# EAGLE design Renesas_Raspi2_Add_On_V1 (EAGLE 9.1.3)

## Sheet 1 of 2
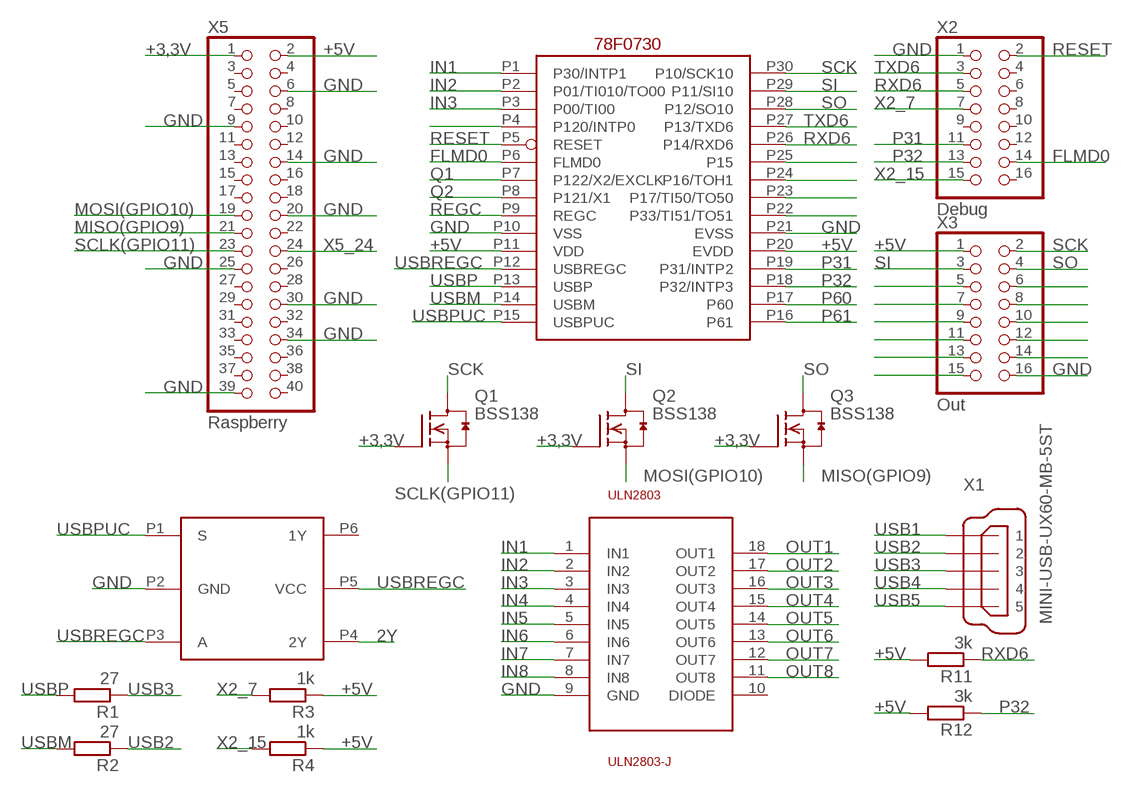
[diagram p0: schematic, sheet 1]

### Parts
Q1  BSS138  [SOT23]
Q2  BSS138  [SOT23]
Q3  BSS138  [SOT23]
R1  27  R-EU_R0603  [R0603]
R2  27  R-EU_R0603  [R0603]
R3  1k  R-EU_R0603  [R0603]
R4  1k  R-EU_R0603  [R0603]
R11  3k  R-EU_R0603  [R0603]
R12  3k  R-EU_R0603  [R0603]
U$1  78F0730_CAB_AX  [SSOP30]
U$2  74LVC1G18  [74LVC1G18]
ULN2803  ULN2803-J  [SOJ18-45]
X1  MINI-USB-UX60-MB-5ST  [UX60-MB-5ST]
X2  Debug  PINHD-2X8  [2X08]
X3  Out  PINHD-2X8  [2X08]
X5  Raspberry  PINHD-2X20  [2X20]

### Nets
2Y: U$2.P4(2Y) ; also sheet 2
+3,3V: Q1.1(G) Q2.1(G) Q3.1(G) X5.1 ; also sheet 2
+5V: R3.1 R4.1 R11.2 R12.2 U$1.P11(VDD) U$1.P20(EVDD) X3.1 X5.2 ; also sheet 2
FLMD0: U$1.P6(FLMD0) X2.14
GND: U$1.P10(VSS) U$1.P21(EVSS) U$2.P2(GND) ULN2803.9(GND) X2.1 X3.16 X5.6 X5.9 X5.14 X5.20 X5.25 X5.30 X5.34 X5.39 ; also sheet 2
IN1: U$1.P1(P30/INTP1) ULN2803.1(IN1)
IN2: U$1.P2(P01/TI010/TO00) ULN2803.2(IN2)
IN3: U$1.P3(P00/TI00) ULN2803.3(IN3)
IN4: ULN2803.4(IN4)
IN5: ULN2803.5(IN5)
IN6: ULN2803.6(IN6)
IN7: ULN2803.7(IN7)
IN8: ULN2803.8(IN8)
MISO(GPIO9): Q3.2(S) X5.21 ; also sheet 2
MOSI(GPIO10): Q2.2(S) X5.19 ; also sheet 2
N$4: U$1.P25(P15)
N$5: X3.5
N$6: X3.7
N$7: U$1.P4(P120/INTP0)
N$8: X3.9
N$9: X3.11
N$10: X3.13
N$11: X3.15
N$12: U$1.P24(P16/TOH1)
N$13: U$1.P23(P17/TI50/TO50)
N$14: X3.6
N$15: X3.8
N$16: X3.10
N$17: X3.12
N$18: X3.14
N$19: U$1.P22(P33/TI51/TO51)
OUT1: ULN2803.18(OUT1)
OUT2: ULN2803.17(OUT2)
OUT3: ULN2803.16(OUT3)
OUT4: ULN2803.15(OUT4)
OUT5: ULN2803.14(OUT5)
OUT6: ULN2803.13(OUT6)
OUT7: ULN2803.12(OUT7)
OUT8: ULN2803.11(OUT8)
P31: U$1.P19(P31/INTP2) X2.11
P32: R12.1 U$1.P18(P32/INTP3) X2.13
P60: U$1.P17(P60) ; also sheet 2
P61: U$1.P16(P61) ; also sheet 2
Q1: U$1.P7(P122/X2/EXCLK) ; also sheet 2
Q2: U$1.P8(P121/X1) ; also sheet 2
REGC: U$1.P9(REGC) ; also sheet 2
RESET: U$1.P5(RESET) X2.2 ; also sheet 2
RXD6: R11.1 U$1.P26(P14/RXD6) X2.5
SCK: Q1.3(D) U$1.P30(P10/SCK10) X3.2 ; also sheet 2
SCLK(GPIO11): Q1.2(S) X5.23 ; also sheet 2
SI: Q2.3(D) U$1.P29(P11/SI10) X3.3 ; also sheet 2
SO: Q3.3(D) U$1.P28(P12/SO10) X3.4 ; also sheet 2
TXD6: U$1.P27(P13/TXD6) X2.3
USB1: X1.1
USB2: R2.1 X1.2
USB3: R1.1 X1.3 ; also sheet 2
USB4: X1.4
USB5: X1.5
USBM: R2.2 U$1.P14(USBM)
USBP: R1.2 U$1.P13(USBP)
USBPUC: U$1.P15(USBPUC) U$2.P1(S)
USBREGC: U$1.P12(USBREGC) U$2.P3(A) U$2.P5(VCC) ; also sheet 2
X2_7: R3.2 X2.7
X2_15: R4.2 X2.15 ; also sheet 2
X5_24: X5.24 ; also sheet 2
Unconnected: U$2.P6(1Y) ULN2803.10(DIODE) X2.4 X2.6 X2.8 X2.9 X2.10 X2.12 X2.16 X5.3 X5.4 X5.5 X5.7 X5.8 X5.10 X5.11 X5.12 X5.13 X5.15 X5.16 X5.17 X5.18 X5.22 X5.26 X5.27 X5.28 X5.29 X5.31 X5.32 X5.33 X5.35 X5.36 X5.37 X5.38 X5.40

### Notes on the sheet
- 78F0730

## Sheet 2 of 2
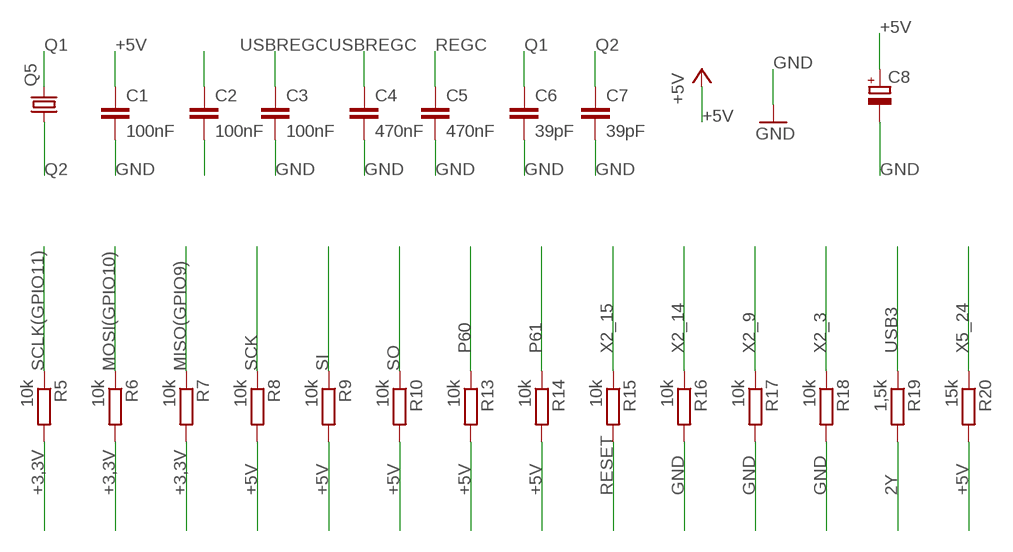
[diagram p1: schematic, sheet 2]

### Parts
C1  100nF  C-EUC0603  [C0603]
C2  100nF  C-EUC0603  [C0603]
C3  100nF  C-EUC0603  [C0603]
C4  470nF  C-EUC0603  [C0603]
C5  470nF  C-EUC0603  [C0603]
C6  39pF  C-EUC0603  [C0603]
C7  39pF  C-EUC0603  [C0603]
C8  CPOL-EUSANYO_SMD_F8  [SANYO-OSCON_SMD_F8]
Q5  CRYSTALHC49UP  [HC49UP]
R5  10k  R-EU_R0603  [R0603]
R6  10k  R-EU_R0603  [R0603]
R7  10k  R-EU_R0603  [R0603]
R8  10k  R-EU_R0603  [R0603]
R9  10k  R-EU_R0603  [R0603]
R10  10k  R-EU_R0603  [R0603]
R13  10k  R-EU_R0603  [R0603]
R14  10k  R-EU_R0603  [R0603]
R15  10k  R-EU_R0603  [R0603]
R16  10k  R-EU_R0603  [R0603]
R17  10k  R-EU_R0603  [R0603]
R18  10k  R-EU_R0603  [R0603]
R19  1,5k  R-EU_R0603  [R0603]
R20  15k  R-EU_R0603  [R0603]

### Nets
2Y: R19.2 ; also sheet 1
+3,3V: R5.2 R6.2 R7.2 ; also sheet 1
+5V: C1.1 C8.+ R8.2 R9.2 R10.2 R13.2 R14.2 R20.2 ; also sheet 1
GND: C1.2 C3.2 C4.2 C5.2 C6.2 C7.2 C8.- R16.2 R17.2 R18.2 ; also sheet 1
MISO(GPIO9): R7.1 ; also sheet 1
MOSI(GPIO10): R6.1 ; also sheet 1
N$1: C2.1
N$3: C2.2
P60: R13.1 ; also sheet 1
P61: R14.1 ; also sheet 1
Q1: C6.1 Q5.2 ; also sheet 1
Q2: C7.1 Q5.1 ; also sheet 1
REGC: C5.1 ; also sheet 1
RESET: R15.2 ; also sheet 1
SCK: R8.1 ; also sheet 1
SCLK(GPIO11): R5.1 ; also sheet 1
SI: R9.1 ; also sheet 1
SO: R10.1 ; also sheet 1
USB3: R19.1 ; also sheet 1
USBREGC: C3.1 C4.1 ; also sheet 1
X2_3: R18.1
X2_9: R17.1
X2_14: R16.1
X2_15: R15.1 ; also sheet 1
X5_24: R20.1 ; also sheet 1

## Library data of the parts
C1-C7 = rcl:C-EU: CAPACITOR, European symbol; SPICEPREFIX: C
C8 = rcl:CPOL-EU: POLARIZED CAPACITOR, European symbol; SPICEPREFIX: C
Q1-Q3 = m-pad-2.1:BSS138: Fairchild Semiconductors BSS138 N-Channel Logic Level Enhancement Mode Field Effect Transistor General Description: These N-Channel enhancement mode field effect transistors are produced using Fairchild's proprietary, high cell density, DMOS technology. These products have been designed to minimize on-state resistance while provide rugged, reliable, and fast switching performance.These products are particularly suited for low voltage, low current applications such as small servo motor control, power MOSFET gate drivers, and other switching applications. Features: 0.22 A, 50 V. RDS(ON) = 3.5Ohm @ VGS = 10 V RDS(ON) = 6.0Ohm @ VGS = 4.5 V High density cell design for extremely low RDS(ON) Rugged and Reliable Compact industry standard SOT-23 surface mount package Please send any comments to: messi@users.sourceforge.net
Q5 = crystal:CRYSTAL: CRYSTAL; OC_FARNELL: unknown; OC_NEWARK: unknown
R1-R20 = rcl:R-EU_: RESISTOR, European symbol; SPICEPREFIX: R
U$1 = Renesas_78k0_0_2:78F0730_CAB_AX
U$2 = Hand_Solder_Special:74LVC1G18
ULN2803 = uln2803:ULN2803-J
X1 = con-hirose:MINI-USB-: MINI USB Connector Source: http://www.hirose.co.jp/cataloge_hp/e24000019.pdf; OC_FARNELL: unknown; OC_NEWARK: unknown
X2 X3 = pinhead_2mm:PINHD-2X8: PIN HEADER
X5 = pinhead_2mm:PINHD-2X20: PIN HEADER

## Board
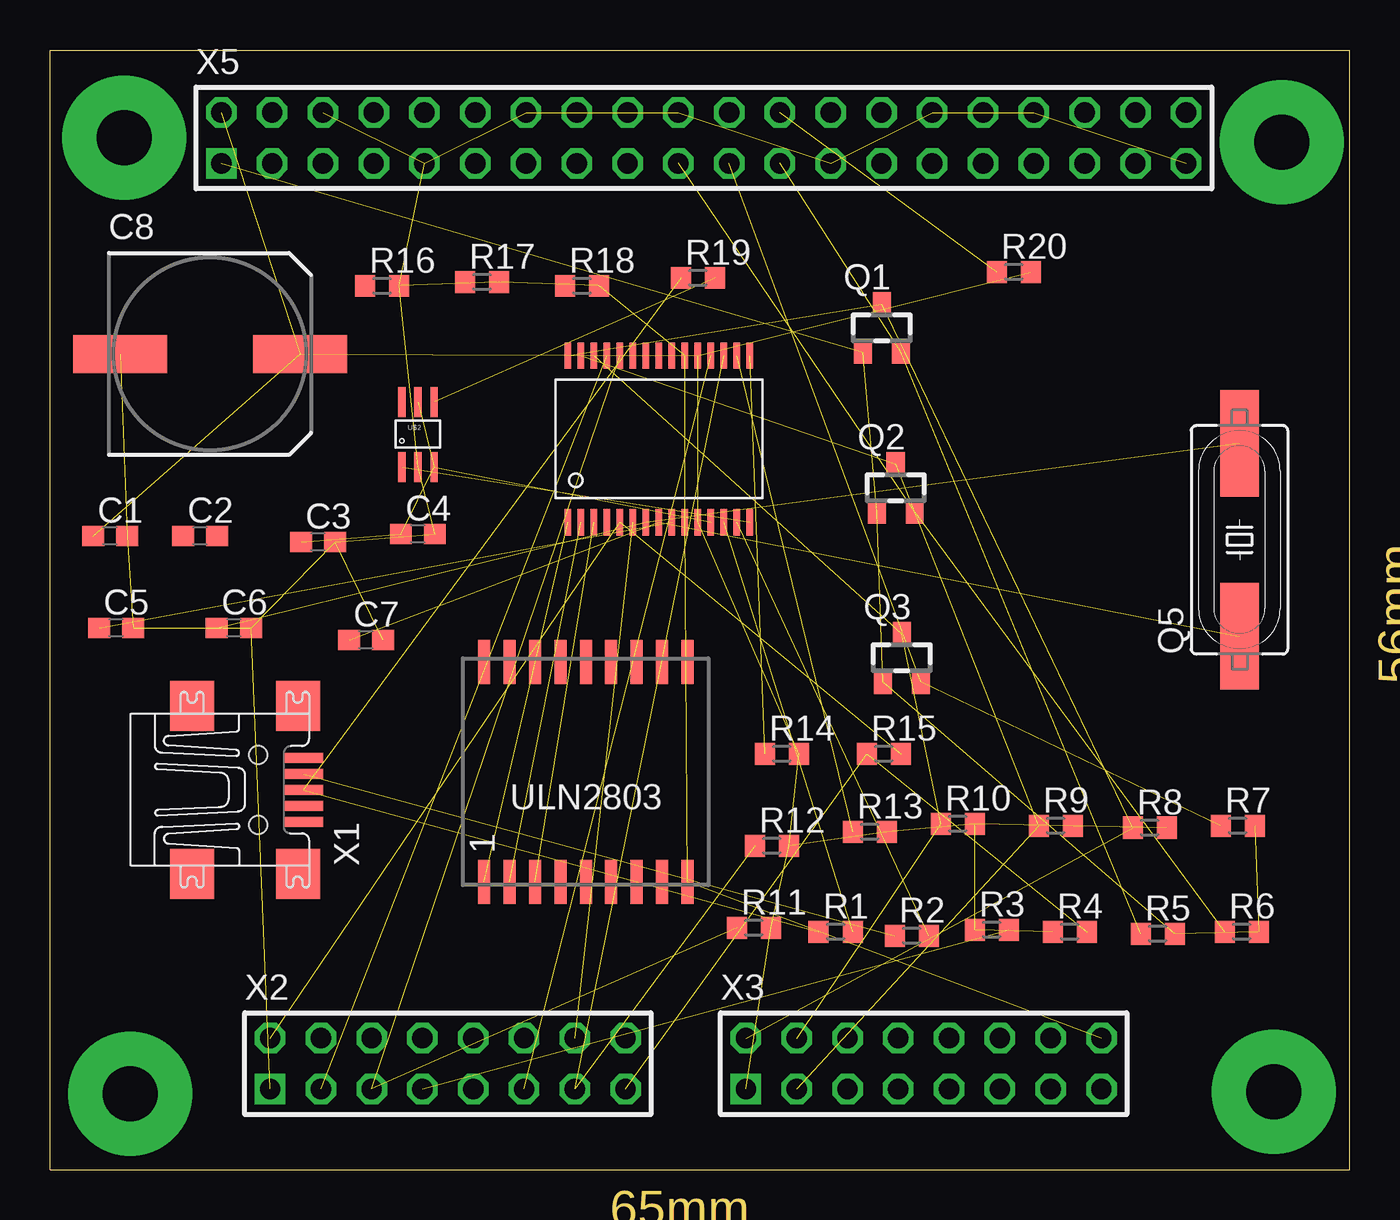
[diagram p2: board, top side]

Size 65 x 56 mm. Coordinates in mm from the lower left corner, seen from the top.
Outline: 0,0 65,0 65,56 0,56 0,0
Copper layers (1*16): Top 0.035mm / dielectric 1.5mm / Bottom 0.035mm
Design rules "default": minimum track width 10mil, minimum drill 24mil, track to track 8mil, track to pad 8mil, pad to pad 8mil, via to via 8mil, smd to smd 8mil, copper to edge 40mil, drill to drill 8mil, minimum pad ring 10mil, minimum via ring 8mil, stop-mask expansion 4mil, vias tented up to drill 0mil, thermal gap 10mil

### Footprints (pad centres in the part's own frame; a part is rotated, then mirrored left to right if it is on the bottom)
C0603 = smd 1.1 x 1: 1 -0.85,0; 2 0.85,0
SANYO-OSCON_SMD_F8 = smd 4.7 x 1.9: + 4.5,0; - -4.5,0
SOT23 = smd 0.9 x 1.2: 1 -0.95,-1.2; 2 0.95,-1.2; 3 0,1.2
HC49UP = smd 5.334 x 1.93: 1 -4.826,0; 2 4.826,0
R0603 = smd 1 x 1.1: 1 -0.85,0; 2 0.85,0
SSOP30 = smd 0.34 x 1.32: P1 -4.296,-4.423; P2 -3.646,-4.423; P3 -2.996,-4.423; P4 -2.346,-4.423; P5 -1.696,-4.423; P6 -1.046,-4.423; P7 -0.396,-4.423; P8 0.254,-4.423; P9 0.904,-4.423; P10 1.554,-4.423; P11 2.204,-4.423; P12 2.854,-4.423; P13 3.504,-4.423; P14 4.154,-4.423; P15 4.804,-4.423; P16 4.804,3.915; P17 4.154,3.915; P18 3.504,3.915; P19 2.854,3.915; P20 2.204,3.915; P21 1.554,3.915; P22 0.904,3.915; P23 0.254,3.915; P24 -0.396,3.915; P25 -1.046,3.915; P26 -1.696,3.915; P27 -2.346,3.915; P28 -2.996,3.915; P29 -3.646,3.915; P30 -4.296,3.915
74LVC1G18 = smd 0.35 x 1.5: P1 -0.8,-1.65; P2 0,-1.65; P3 0.8,-1.65; P4 0.8,1.6; P5 0,1.6; P6 -0.8,1.6
SOJ18-45 = smd 0.6 x 2.2: 1 -5.08,-5.5; 2 -3.81,-5.5; 3 -2.54,-5.5; 4 -1.27,-5.5; 5 0,-5.5; 6 1.27,-5.5; 7 2.54,-5.5; 8 3.81,-5.5; 9 5.08,-5.5; 10 5.08,5.5; 11 3.81,5.5; 12 2.54,5.5; 13 1.27,5.5; 14 0,5.5; 15 -1.27,5.5; 16 -2.54,5.5; 17 -3.81,5.5; 18 -5.08,5.5
UX60-MB-5ST = smd 2 x 0.5: 1 2.25,1.6; 2 2.25,0.8; 3 2.25,0; 4 2.25,-0.8; 5 2.25,-1.6 | smd 2.2 x 2.5: M1 -3.3,-4.2; M2 -3.3,4.2; M3 2,4.2; M4 2,-4.2 | hole 0.9: 0,-1.75; 0,1.75
2X08 = drill 1.016 square: 1 -8.89,-1.27 | drill 1.016 octagon: 2 -8.89,1.27; 3 -6.35,-1.27; 4 -6.35,1.27; 5 -3.81,-1.27; 6 -3.81,1.27; 7 -1.27,-1.27; 8 -1.27,1.27; 9 1.27,-1.27; 10 1.27,1.27; 11 3.81,-1.27; 12 3.81,1.27; 13 6.35,-1.27; 14 6.35,1.27; 15 8.89,-1.27; 16 8.89,1.27
2X20 = drill 1.016 square: 1 -24.13,-1.27 | drill 1.016 octagon: 2 -24.13,1.27; 3 -21.59,-1.27; 4 -21.59,1.27; 5 -19.05,-1.27; 6 -19.05,1.27; 7 -16.51,-1.27; 8 -16.51,1.27; 9 -13.97,-1.27; 10 -13.97,1.27; 11 -11.43,-1.27; 12 -11.43,1.27; 13 -8.89,-1.27; 14 -8.89,1.27; 15 -6.35,-1.27; 16 -6.35,1.27; 17 -3.81,-1.27; 18 -3.81,1.27; 19 -1.27,-1.27; 20 -1.27,1.27; 21 1.27,-1.27; 22 1.27,1.27; 23 3.81,-1.27; 24 3.81,1.27; 25 6.35,-1.27; 26 6.35,1.27; 27 8.89,-1.27; 28 8.89,1.27; 29 11.43,-1.27; 30 11.43,1.27; 31 13.97,-1.27; 32 13.97,1.27; 33 16.51,-1.27; 34 16.51,1.27; 35 19.05,-1.27; 36 19.05,1.27; 37 21.59,-1.27; 38 21.59,1.27; 39 24.13,-1.27; 40 24.13,1.27

### Placement (x,y rotation side)
C1  3,31.7 0 top
C2  7.5,31.7 0 top
C3  13.4,31.4 0 top
C4  18.4,31.8 0 top
C5  3.3,27.1 0 top
C6  9.2,27.1 0 top
C7  15.8,26.5 0 top
C8  8,40.8 0 top
Q1  41.6,42.1 0 top
Q2  42.3,34.1 0 top
Q3  42.6,25.6 0 top
Q5  59.5,31.5 90 top
R1  39.3,11.9 0 top
R2  43.1,11.7 0 top
R3  47.1,12 0 top
R4  51,11.9 0 top
R5  55.4,11.8 0 top
R6  59.6,11.9 0 top
R7  59.4,17.2 0 top
R8  55,17.1 0 top
R9  50.3,17.2 0 top
R10  45.4,17.3 0 top
R11  35.2,12.1 0 top
R12  36.1,16.2 0 top
R13  41,16.9 0 top
R14  36.6,20.8 0 top
R15  41.7,20.8 0 top
R16  16.6,44.2 0 top
R17  21.6,44.4 0 top
R18  26.6,44.2 0 top
R19  32.4,44.6 0 top
R20  48.2,44.9 0 top
U$1  30.2,36.8 0 top
U$2  18.4,36.8 0 top
ULN2803  26.8,19.9 0 top
X1  10.4,19 0 top
X2  19.9,5.3 0 top
X3  43.7,5.3 0 top
X5  32.7,51.6 0 top

### Tracks (layer width: path | path; a pad name or v marks a point on that pad's centre or on a via)
2Y  (1 unrouted)
+3,3V  (6 unrouted)
+5V  (15 unrouted)
FLMD0  (1 unrouted)
GND  (23 unrouted)
IN1  (1 unrouted)
IN2  (1 unrouted)
IN3  (1 unrouted)
MISO(GPIO9)  (2 unrouted)
MOSI(GPIO10)  (2 unrouted)
N$2  (via drill 2.75 pad 6.2)
  other vias: 3.7,51.6 4,3.8 61.6,51.4 61.2,3.9
P31  (1 unrouted)
P32  (2 unrouted)
P60  (1 unrouted)
P61  (1 unrouted)
Q1  (2 unrouted)
Q2  (2 unrouted)
REGC  (1 unrouted)
RESET  (2 unrouted)
RXD6  (2 unrouted)
SCK  (3 unrouted)
SCLK(GPIO11)  (2 unrouted)
SI  (3 unrouted)
SO  (3 unrouted)
TXD6  (1 unrouted)
USB2  (1 unrouted)
USB3  (2 unrouted)
USBM  (1 unrouted)
USBP  (1 unrouted)
USBPUC  (1 unrouted)
USBREGC  (4 unrouted)
X2_7  (1 unrouted)
X2_15  (2 unrouted)
X5_24  (1 unrouted)

### Text on the board
Dimension: 56mm | 65mm